# EAGLE design connect4V2 (EAGLE 9.7.0)
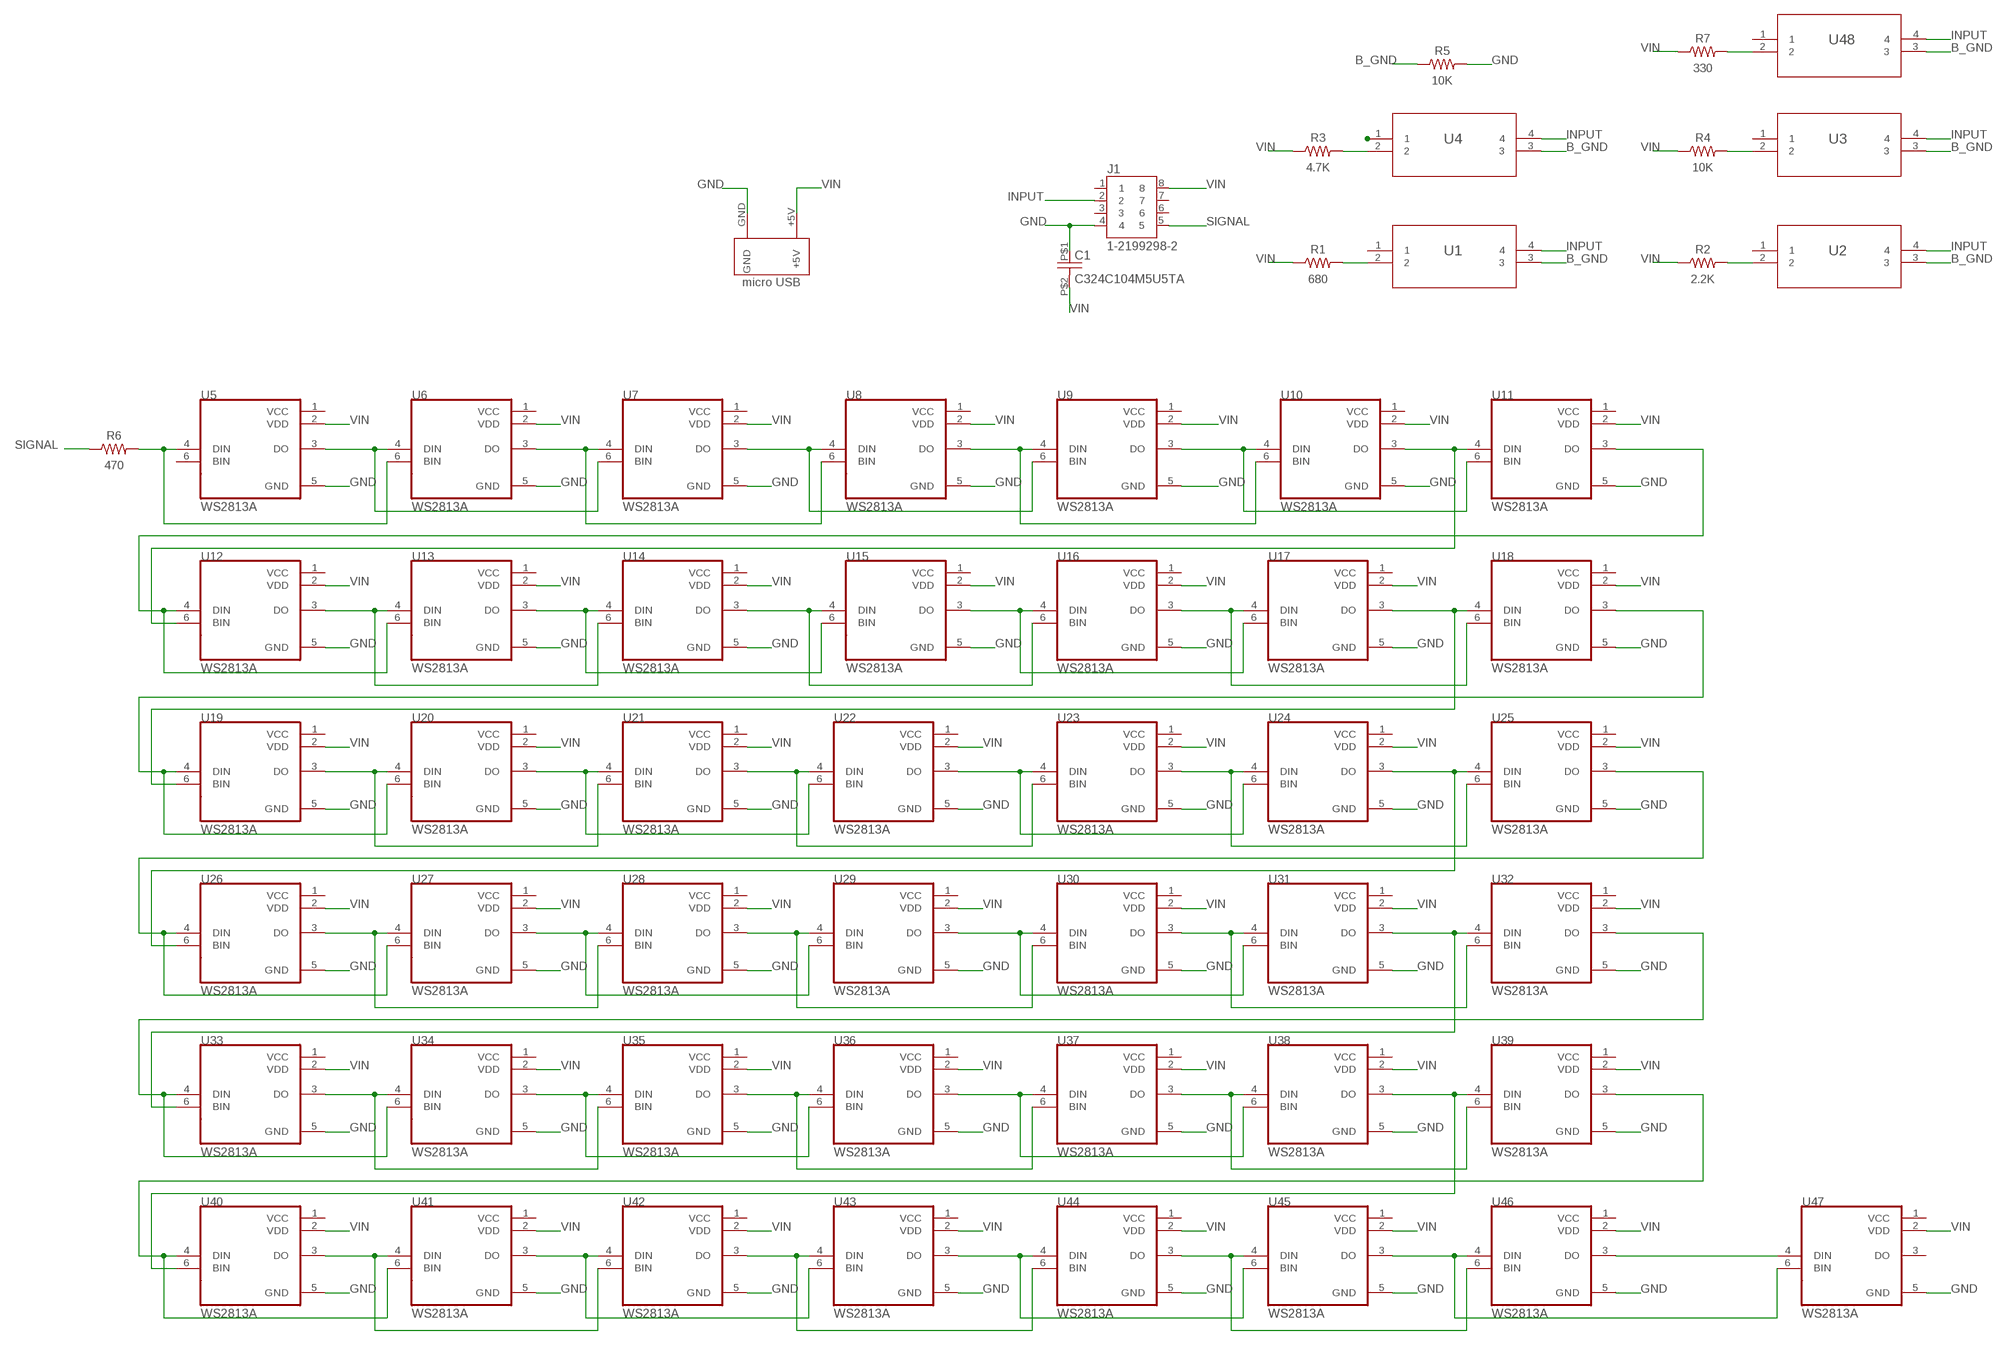
[diagram p0: schematic, sheet 1]

## Parts
C1  C324C104M5U5TA  [CAPRR254W55L508T318H508P]
J1  1-2199298-2  [TE_1-2199298-2]
R1  680  R-US_AXIAL-7.2MM-PITCH  [RESAD724W46L381D178B]
R2  2.2K  R-US_AXIAL-7.2MM-PITCH  [RESAD724W46L381D178B]
R3  4.7K  R-US_AXIAL-7.2MM-PITCH  [RESAD724W46L381D178B]
R4  10K  R-US_AXIAL-7.2MM-PITCH  [RESAD724W46L381D178B]
R5  10K  R-US_AXIAL-7.2MM-PITCH  [RESAD724W46L381D178B]
R6  470  R-US_AXIAL-7.2MM-PITCH  [RESAD724W46L381D178B]
R7  330  R-US_AXIAL-7.2MM-PITCH  [RESAD724W46L381D178B]
U1  PTS526_SK15_SMTR2_LFSSMT_FS-M  [SMT_FS-M]
U2  PTS526_SK15_SMTR2_LFSSMT_FS-M  [SMT_FS-M]
U3  PTS526_SK15_SMTR2_LFSSMT_FS-M  [SMT_FS-M]
U4  PTS526_SK15_SMTR2_LFSSMT_FS-M  [SMT_FS-M]
U5  WS2813A  [LED_WS2813A]
U6  WS2813A  [LED_WS2813A]
U7  WS2813A  [LED_WS2813A]
U8  WS2813A  [LED_WS2813A]
U9  WS2813A  [LED_WS2813A]
U10  WS2813A  [LED_WS2813A]
U11  WS2813A  [LED_WS2813A]
U12  WS2813A  [LED_WS2813A]
U13  WS2813A  [LED_WS2813A]
U14  WS2813A  [LED_WS2813A]
U15  WS2813A  [LED_WS2813A]
U16  WS2813A  [LED_WS2813A]
U17  WS2813A  [LED_WS2813A]
U18  WS2813A  [LED_WS2813A]
U19  WS2813A  [LED_WS2813A]
U20  WS2813A  [LED_WS2813A]
U21  WS2813A  [LED_WS2813A]
U22  WS2813A  [LED_WS2813A]
U23  WS2813A  [LED_WS2813A]
U24  WS2813A  [LED_WS2813A]
U25  WS2813A  [LED_WS2813A]
U26  WS2813A  [LED_WS2813A]
U27  WS2813A  [LED_WS2813A]
U28  WS2813A  [LED_WS2813A]
U29  WS2813A  [LED_WS2813A]
U30  WS2813A  [LED_WS2813A]
U31  WS2813A  [LED_WS2813A]
U32  WS2813A  [LED_WS2813A]
U33  WS2813A  [LED_WS2813A]
U34  WS2813A  [LED_WS2813A]
U35  WS2813A  [LED_WS2813A]
U36  WS2813A  [LED_WS2813A]
U37  WS2813A  [LED_WS2813A]
U38  WS2813A  [LED_WS2813A]
U39  WS2813A  [LED_WS2813A]
U40  WS2813A  [LED_WS2813A]
U41  WS2813A  [LED_WS2813A]
U42  WS2813A  [LED_WS2813A]
U43  WS2813A  [LED_WS2813A]
U44  WS2813A  [LED_WS2813A]
U45  WS2813A  [LED_WS2813A]
U46  WS2813A  [LED_WS2813A]
U47  WS2813A  [LED_WS2813A]
U48  PTS526_SK15_SMTR2_LFSSMT_FS-M  [SMT_FS-M]
U$1  MICROUSB-5P-FEMALE-AB  [MICROUSB-5P-FEMALE-AB]

## Nets
B_GND: R5.1 U1.3 U2.3 U3.3 U4.3 U48.3
GND: C1.P$1 J1.4 R5.2 U5.5(GND) U6.5(GND) U7.5(GND) U8.5(GND) U9.5(GND) U10.5(GND) U11.5(GND) U12.5(GND) U13.5(GND) U14.5(GND) U15.5(GND) U16.5(GND) U17.5(GND) U18.5(GND) U19.5(GND) U20.5(GND) U21.5(GND) U22.5(GND) U23.5(GND) U24.5(GND) U25.5(GND) U26.5(GND) U27.5(GND) U28.5(GND) U29.5(GND) U30.5(GND) U31.5(GND) U32.5(GND) U33.5(GND) U34.5(GND) U35.5(GND) U36.5(GND) U37.5(GND) U38.5(GND) U39.5(GND) U40.5(GND) U41.5(GND) U42.5(GND) U43.5(GND) U44.5(GND) U45.5(GND) U46.5(GND) U47.5(GND) U$1.GND
INPUT: J1.2 U1.4 U2.4 U3.4 U4.4 U48.4
N$1: U6.3(DO) U7.4(DIN) U8.6(BIN)
N$2: U5.3(DO) U6.4(DIN) U7.6(BIN)
N$3: U7.3(DO) U8.4(DIN) U9.6(BIN)
N$4: U8.3(DO) U9.4(DIN) U10.6(BIN)
N$5: U10.3(DO) U11.4(DIN) U12.6(BIN)
N$6: U13.3(DO) U14.4(DIN) U15.6(BIN)
N$7: U30.3(DO) U31.4(DIN) U32.6(BIN)
N$8: U12.3(DO) U13.4(DIN) U14.6(BIN)
N$9: U14.3(DO) U15.4(DIN) U16.6(BIN)
N$10: U15.3(DO) U16.4(DIN) U17.6(BIN)
N$11: U16.3(DO) U17.4(DIN) U18.6(BIN)
N$12: U17.3(DO) U18.4(DIN) U19.6(BIN)
N$13: U19.3(DO) U20.4(DIN) U21.6(BIN)
N$14: U20.3(DO) U21.4(DIN) U22.6(BIN)
N$15: U21.3(DO) U22.4(DIN) U23.6(BIN)
N$16: U22.3(DO) U23.4(DIN) U24.6(BIN)
N$17: U23.3(DO) U24.4(DIN) U25.6(BIN)
N$18: U24.3(DO) U25.4(DIN) U26.6(BIN)
N$19: U18.3(DO) U19.4(DIN) U20.6(BIN)
N$20: U26.3(DO) U27.4(DIN) U28.6(BIN)
N$21: U27.3(DO) U28.4(DIN) U29.6(BIN)
N$22: U28.3(DO) U29.4(DIN) U30.6(BIN)
N$23: U29.3(DO) U30.4(DIN) U31.6(BIN)
N$24: U4.1
N$25: U31.3(DO) U32.4(DIN) U33.6(BIN)
N$26: U25.3(DO) U26.4(DIN) U27.6(BIN)
N$27: U33.3(DO) U34.4(DIN) U35.6(BIN)
N$28: U34.3(DO) U35.4(DIN) U36.6(BIN)
N$29: U35.3(DO) U36.4(DIN) U37.6(BIN)
N$30: U36.3(DO) U37.4(DIN) U38.6(BIN)
N$31: U37.3(DO) U38.4(DIN) U39.6(BIN)
N$32: U38.3(DO) U39.4(DIN) U40.6(BIN)
N$33: U32.3(DO) U33.4(DIN) U34.6(BIN)
N$34: U40.3(DO) U41.4(DIN) U42.6(BIN)
N$35: U41.3(DO) U42.4(DIN) U43.6(BIN)
N$36: U42.3(DO) U43.4(DIN) U44.6(BIN)
N$37: U11.3(DO) U12.4(DIN) U13.6(BIN)
N$38: U43.3(DO) U44.4(DIN) U45.6(BIN)
N$39: U44.3(DO) U45.4(DIN) U46.6(BIN)
N$40: U45.3(DO) U46.4(DIN) U47.6(BIN)
N$41: U39.3(DO) U40.4(DIN) U41.6(BIN)
N$42: U46.3(DO) U47.4(DIN)
N$43: R1.2 U1.2
N$44: R3.2 U4.2
N$45: R2.2 U2.2
N$46: R4.2 U3.2
N$47: U9.3(DO) U10.4(DIN) U11.6(BIN)
N$48: R7.2 U48.2
N$49: R6.2 U5.4(DIN) U6.6(BIN)
SIGNAL: J1.5 R6.1
VIN: C1.P$2 J1.8 R1.1 R2.1 R3.1 R4.1 R7.1 U5.2(VDD) U6.2(VDD) U7.2(VDD) U8.2(VDD) U9.2(VDD) U10.2(VDD) U11.2(VDD) U12.2(VDD) U13.2(VDD) U14.2(VDD) U15.2(VDD) U16.2(VDD) U17.2(VDD) U18.2(VDD) U19.2(VDD) U20.2(VDD) U21.2(VDD) U22.2(VDD) U23.2(VDD) U24.2(VDD) U25.2(VDD) U26.2(VDD) U27.2(VDD) U28.2(VDD) U29.2(VDD) U30.2(VDD) U31.2(VDD) U32.2(VDD) U33.2(VDD) U34.2(VDD) U35.2(VDD) U36.2(VDD) U37.2(VDD) U38.2(VDD) U39.2(VDD) U40.2(VDD) U41.2(VDD) U42.2(VDD) U43.2(VDD) U44.2(VDD) U45.2(VDD) U46.2(VDD) U47.2(VDD) U$1.+5V
Unconnected: J1.1 J1.3 J1.6 J1.7 U1.1 U2.1 U3.1 U5.6(BIN) U47.3(DO) U48.1

## Power pins joined to a net without a drawn wire
VCC: U5.1(VCC) U6.1(VCC) U7.1(VCC) U8.1(VCC) U9.1(VCC) U10.1(VCC) U11.1(VCC) U12.1(VCC) U13.1(VCC) U14.1(VCC) U15.1(VCC) U16.1(VCC) U17.1(VCC) U18.1(VCC) U19.1(VCC) U20.1(VCC) U21.1(VCC) U22.1(VCC) U23.1(VCC) U24.1(VCC) U25.1(VCC) U26.1(VCC) U27.1(VCC) U28.1(VCC) U29.1(VCC) U30.1(VCC) U31.1(VCC) U32.1(VCC) U33.1(VCC) U34.1(VCC) U35.1(VCC) U36.1(VCC) U37.1(VCC) U38.1(VCC) U39.1(VCC) U40.1(VCC) U41.1(VCC) U42.1(VCC) U43.1(VCC) U44.1(VCC) U45.1(VCC) U46.1(VCC) U47.1(VCC)

## Library data of the parts
C1 = ceramicCap:C324C104M5U5TA: Cap Ceramic 0.1uF 50V Z5U 20% Radial 2.54mm 85C Bulk; MANUFACTURER: Kemet
J1 = 8PinDip:1-2199298-2: CONN IC DIP SOCKET 8POS TIN; COMMENT: 1-2199298-2
R1-R7 = Resistor:R-US: Resistor Fixed - ANSI; CATEGORY: Resistor; SUB-CATEGORY: Fixed
U1-U4 U48 = SMD_Button:PTS526_SK15_SMTR2_LFS; BUILT_BY: EMA_Matt; COPYRIGHT: Copyright (C) 2018 Accelerated Designs. All rights reserved; MANUFACTURER_PART_NUMBER: PTS526 SK15 SMTR2 LFS; SOURCELIBRARY: C&K_2019-11-15; VENDOR: C&K
U5-U47 = WS2813A:WS2813A: Intelligent control LED integrated light source; MANUFACTURER: Worldsemi; STANDARD: Manufacturer Recommendations
U$1 = MICROUSB-5P-FEMALE-AB:MICROUSB-5P-FEMALE-AB

## Board
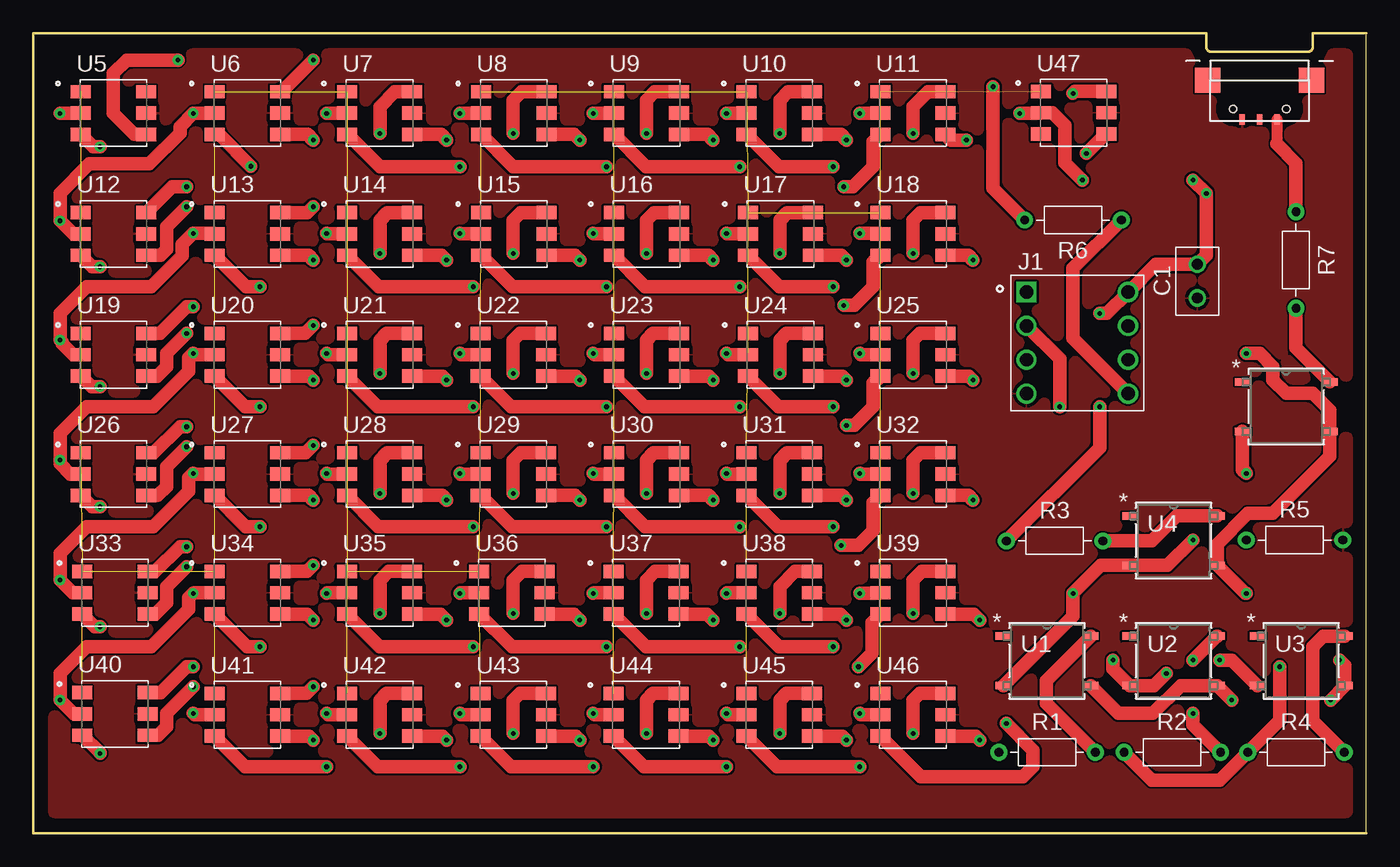
[diagram p1: board, top side]
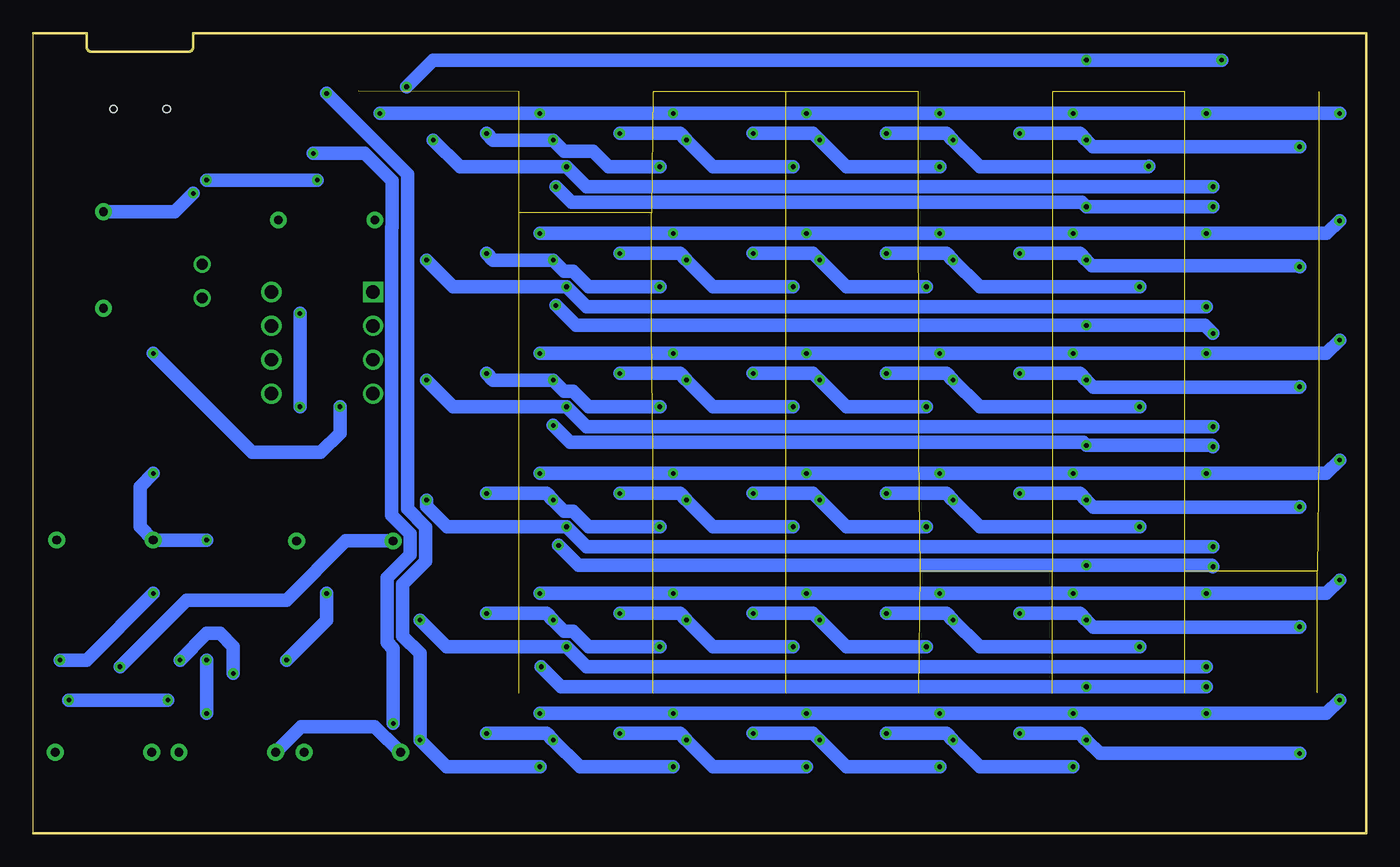
[diagram p2: board, bottom side, seen from below]

Size 100 x 60 mm. Coordinates in mm from the lower left corner, seen from the top.
Outline: 100,0 100,60 96,60 96,59 arc-90 95.6,58.6 88.4,58.6 arc-90 88,59 88,60 0,60 0,0 100,0
Copper layers (1*16): Top 0.035mm / dielectric 1.5mm / Bottom 0.035mm
Design rules "default": minimum track width 6mil, minimum drill 0.35mm, track to track 6mil, track to pad 6mil, pad to pad 6mil, via to via 6mil, smd to smd 6mil, copper to edge 40mil, drill to drill 6mil, minimum pad ring 10mil, minimum via ring 8mil, stop-mask expansion 4mil, vias tented up to drill 0mil, thermal gap 10mil

### Footprints (pad centres in the part's own frame; a part is rotated, then mirrored left to right if it is on the bottom)
CAPRR254W55L508T318H508P = drill 0.8: P$1 -1.27,0; P$2 1.27,0
TE_1-2199298-2 = drill 1 square: 1 -3.81,3.81 | drill 1: 2 -3.81,1.27; 3 -3.81,-1.27; 4 -3.81,-3.81; 5 3.81,-3.81; 6 3.81,-1.27; 7 3.81,1.27; 8 3.81,3.81
RESAD724W46L381D178B = drill 0.66 pad 1.26: 1 -3.62,0; 2 3.62,0
SMT_FS-M = smd 1.156 x 0.559: 1 -3.283,1.854; 2 3.283,1.854; 3 -3.283,-1.854; 4 3.283,-1.854
LED_WS2813A = smd 1.5 x 1: 1 -2.45,1.6; 2 -2.45,0; 3 -2.45,-1.6; 4 2.45,-1.6; 5 2.45,0; 6 2.45,1.6
MICROUSB-5P-FEMALE-AB = smd 0.406 x 0.813: +5V -1.3,0; GND 1.3,0; NC 0,0 | smd 1.9 x 1.9: HOLD1 -3.9,-2.95; HOLD2 3.9,-2.95 | hole 0.55: 2,-0.8; -2,-0.8

### Placement (x,y rotation side)
C1  87.33,41.41 90 top
J1  78.33,36.79 0 top
R1  76.06,6.08 0 top
R2  85.45,6.08 0 top
R3  76.63,21.93 0 top
R4  94.73,6.08 0 top
R5  94.63,22 0 top
R6  78,46 180 top
R7  94.73,43 270 top
U1  76.06,12.93 0 top
U2  85.55,12.93 0 top
U3  95.12,12.93 0 top
U4  85.55,21.95 0 top
U5  6.02,54.02 0 top
U6  16.05,54.02 0 top
U7  25.98,54.02 0 top
U8  36.04,54.02 0 top
U9  46,54.02 0 top
U10  55.96,54.02 0 top
U11  65.99,54.02 0 top
U12  6.02,44.96 0 top
U13  16.05,44.96 0 top
U14  25.98,44.96 0 top
U15  36.04,44.96 0 top
U16  46,44.96 0 top
U17  56.06,44.96 0 top
U18  65.99,44.96 0 top
U19  6.02,35.9 0 top
U20  16.05,35.9 0 top
U21  25.98,35.9 0 top
U22  36.01,35.9 0 top
U23  46,35.9 0 top
U24  56.06,35.9 0 top
U25  65.99,35.9 0 top
U26  6.02,26.94 0 top
U27  16.05,26.94 0 top
U28  25.98,26.94 0 top
U29  36.01,26.94 0 top
U30  46,26.94 0 top
U31  55.96,26.94 0 top
U32  65.99,26.94 0 top
U33  6.12,18.05 0 top
U34  16.05,18.05 0 top
U35  25.98,18.05 0 top
U36  35.91,18.05 0 top
U37  45.97,18.05 0 top
U38  55.96,18.05 0 top
U39  65.99,18.05 0 top
U40  6.12,8.96 0 top
U41  16.05,8.89 0 top
U42  25.98,8.89 0 top
U43  36.01,8.89 0 top
U44  45.97,8.89 0 top
U45  55.96,8.89 0 top
U46  65.99,8.89 0 top
U47  78.06,54.04 0 top
U48  94,32 0 top
U$1  92,53.53 180 top

### Tracks (layer width: path | path; a pad name or v marks a point on that pad's centre or on a via)
B_GND  (via drill 0.35)
  Top 1.016: v91,27 90.72,27.28 U48.3 | v87,22 85.1,20.1 U4.3 80.1,20.1 v78,18 78,16.3 U1.3 | U3.3 89.92,13 v89,13 | v85,12 84.08,11.08 U2.3 81,12.34 v81,13
  Bottom 1.016: v91,27 92,26 92,22.99 R5.1 v87,22 | v89,13 87,15 86,15 85,14 v85,12 | v81,13 78,16 v78,18
GND
  pour Top: -3,65.5 106,65.5 109.5,62 109.5,-8.5 -4,-8.5 -10,-2.5 -10,58 -3,65
INPUT  (via drill 0.35)
  Top 1.016: v97.33,10 U3.4 98.41,12.59 v98,13 | v89.91,10 U2.4 86.08,11.08 84,9 81.42,9 U1.4 | v91,18 90.93,18 U4.4 88.83,21.7 91.14,24 93,24 97.28,28.28 U48.4 97.28,31.72 96,33 94,33 93,34 93,35 92,36 v91,36 | v77,32 77,35.58 J1.2
  Bottom 1.016: v98,13 96,13 v91,18 | v97.33,10 v89.91,10 | v77,32 77,30 78.43,28.57 83.57,28.57 v91,36
N$1  (via drill 0.35)
  Top 1.016: U6.3 13.93,52.42 v16.32,50.03 | U7.4 30.58,52.42 v31,52 | v36,52.5 36,55 36.62,55.62 U8.6
  Bottom 1.016: v16.32,50.03 16.35,50 29,50 v31,52 31.5,52.5 v36,52.5
N$2  (via drill 0.35)
  Top 1.016: U5.3 4.49,51.5 v5,51.5 | U6.4 20.58,52.42 v21,52 | v26,52.5 26,54.5 27.12,55.62 U7.6
  Bottom 1.016: v5,51.5 20.5,51.5 v21,52 21.5,52.5 v26,52.5
N$3  (via drill 0.35)
  Top 1.016: U7.3 23.58,52.42 26,50 v32,50 | U8.4 40.58,52.42 v41,52 | v46,52.5 46,55 46.62,55.62 U9.6
  Bottom 1.016: v32,50 39,50 v41,52 41.5,52.5 v46,52.5
N$4  (via drill 0.35)
  Top 1.016: U8.3 36.01,50 v43,50 | U9.4 50.58,52.42 v51,52 | v56,52.5 56,55 56.62,55.62 U10.6
  Bottom 1.016: v43,50 49,50 v51,52 51.5,52.5 v56,52.5
N$5  (via drill 0.35)
  Top 1.016: U10.3 55.93,50 v60,50 | v70,52 68.86,52 U11.4 | U12.6 10.41,48.5 v11.5,48.5
  Bottom 1.016: v70,52 68,50 v60,50 58.5,48.5 v11.5,48.5
N$6  (via drill 0.35)
  Top 1.016: U13.3 15.96,41 v17,41 | U14.4 30.64,43.36 v31,43 | v36,43.5 36,46 36.56,46.56 U15.6
  Bottom 1.016: v17,41 29,41 v31,43 31.5,43.5 v36,43.5
N$7  (via drill 0.35)
  Top 1.016: U30.3 45.89,23 v53,23 | U31.4 60.66,25.34 v61,25 | v66,25.5 66,28 66.54,28.54 U32.6
  Bottom 1.016: v53,23 58.35,23 59.52,24.17 60.17,24.17 v61,25 61.5,25.5 v66,25.5
N$8  (via drill 0.35)
  Top 1.016: U12.3 4.43,42.5 v5,42.5 | U13.4 20.64,43.36 v21,43 | v26,43.5 26,46 26.56,46.56 U14.6
  Bottom 1.016: v26,43.5 21.5,43.5 v21,43 20.57,42.57 5.07,42.57 v5,42.5
N$9  (via drill 0.35)
  Top 1.016: U14.3 25.89,41 v33,41 | U15.4 40.64,43.36 v41,43 | v46,43.5 46,46 46.56,46.56 U16.6
  Bottom 1.016: v33,41 39,41 v41,43 41.5,43.5 v46,43.5
N$10  (via drill 0.35)
  Top 1.016: U15.3 35.95,41 v43,41 | U16.4 50.64,43.36 v51,43 | v56,43.5 56,46 56.56,46.56 U17.6
  Bottom 1.016: v43,41 49,41 v51,43 51.5,43.5 v56,43.5
N$11  (via drill 0.35)
  Top 1.016: U16.3 45.91,41 v53,41 | U17.4 60.64,43.36 v61,43 | v66,43.5 66,46 66.56,46.56 U18.6
  Bottom 1.016: v53,41 58.35,41 59.52,42.17 60.17,42.17 v61,43 65.5,43 v66,43.5
N$12  (via drill 0.35)
  Top 1.016: U17.3 55.97,41 v60,41 | U18.4 70.14,43.36 v70.5,43 | v12,39.5 11.5,39.5 9.5,37.5 U19.6
  Bottom 1.016: v70.5,43 68.5,41 v60,41 58.5,39.5 v12,39.5
N$13  (via drill 0.35)
  Top 1.016: U19.3 4.37,33.5 v5,33.5 | U20.4 20.7,34.3 v21,34 | v26,34.5 26,37 26.5,37.5 U21.6
  Bottom 1.016: v26,34.5 21.5,34.5 v21,34 20.47,33.47 5.03,33.47 v5,33.5
N$14  (via drill 0.35)
  Top 1.016: U20.3 15.9,32 v17,32 | U21.4 30.7,34.3 v31,34 | v36,34.5 36,37 36.5,37.5 U22.6
  Bottom 1.016: v17,32 29,32 v31,34 31.5,34.5 v36,34.5
N$15  (via drill 0.35)
  Top 1.016: U21.3 25.83,32 v33,32 | U22.4 40.7,34.3 v41,34 | v46,34.5 46,37 46.5,37.5 U23.6
  Bottom 1.016: v33,32 39,32 v41,34 41.5,34.5 v46,34.5
N$16  (via drill 0.35)
  Top 1.016: U22.3 35.86,32 v43,32 | U23.4 50.7,34.3 v51,34 | v56,34.5 56,37 56.5,37.5 U24.6
  Bottom 1.016: v43,32 49,32 v51,34 51.5,34.5 v56,34.5
N$17  (via drill 0.35)
  Top 1.016: U23.3 45.85,32 v53,32 | U24.4 60.7,34.3 v61,34 | v66,34.5 66,37 66.5,37.5 U25.6
  Bottom 1.016: v53,32 58.35,32 59.52,33.17 60.17,33.17 v61,34 65.5,34 v66,34.5
N$18  (via drill 0.35)
  Top 1.016: U24.3 55.91,32 v60,32 | U25.4 70.2,34.3 v70.5,34 | U26.6 9.04,28.54 11,30.5 v11.5,30.5
  Bottom 1.016: v70.5,34 68.5,32 v60,32 58.5,30.5 v11.5,30.5
N$19  (via drill 0.35)
  Top 1.016: U18.3 63,42.82 63,41 61.6,39.6 v60.8,39.6 | v11.5,37.5 10,36 10,35 9.3,34.3 U19.4 | v21,38.1 20.4,37.5 U20.6
  Bottom 1.016: v60.8,39.6 59.3,38.1 v21,38.1 12.1,38.1 v11.5,37.5
N$20  (via drill 0.35)
  Top 1.016: U26.3 4.41,24.5 v5,24.5 | U27.4 20.66,25.34 v21,25 | v26,25.5 26,28 26.54,28.54 U28.6
  Bottom 1.016: v26,25.5 21.5,25.5 v21,25 20.47,24.47 5.03,24.47 v5,24.5
N$21  (via drill 0.35)
  Top 1.016: U27.3 15.94,23 v17,23 | U28.4 30.66,25.34 v31,25 | v36,25.5 36,28 36.54,28.54 U29.6
  Bottom 1.016: v17,23 29,23 v31,25 31.5,25.5 v36,25.5
N$22  (via drill 0.35)
  Top 1.016: U28.3 25.87,23 v33,23 | U29.4 40.66,25.34 v41,25 | v46,25.5 46,28 46.54,28.54 U30.6
  Bottom 1.016: v33,23 39,23 v41,25 41.5,25.5 v46,25.5
N$23  (via drill 0.35)
  Top 1.016: U29.3 35.9,23 v43,23 | U30.4 50.66,25.34 v51,25 | v56,25.5 56,28 56.54,28.54 U31.6
  Bottom 1.016: v43,23 49,23 v51,25 51.5,25.5 v56,25.5
N$25  (via drill 0.35)
  Top 1.016: U31.3 55.85,23 v60,23 | U32.4 70.16,25.34 v70.5,25 | U33.6 9.15,19.65 11,21.5 v11.5,21.5
  Bottom 1.016: v11.5,21.5 58.5,21.5 v60,23 68.95,23 70.5,24.55 v70.5,25
N$26  (via drill 0.35)
  Top 1.016: U25.3 63,33.76 63,32 61.6,30.6 v61,30.6 | v11.5,29 10,27.5 10,26 9.34,25.34 U26.4 | v21,29.1 20.44,28.54 U27.6
  Bottom 1.016: v11.5,29 11.6,29.1 v21,29.1 21.23,29.33 59.73,29.33 v61,30.6
N$27  (via drill 0.35)
  Top 1.016: U33.3 4.62,15.5 v5,15.5 | U34.4 20.55,16.45 v21,16 | v26,16.5 26,19 26.65,19.65 U35.6
  Bottom 1.016: v26,16.5 21.5,16.5 v21,16 20.47,15.47 5.03,15.47 v5,15.5
N$28  (via drill 0.35)
  Top 1.016: U34.3 16.05,14 v17,14 | U35.4 30.55,16.45 v31,16 | v36,16.5 36,19 36.65,19.65 U36.6
  Bottom 1.016: v17,14 29,14 v31,16 31.5,16.5 v36,16.5
N$29  (via drill 0.35)
  Top 1.016: U35.3 25.98,14 v33,14 | U36.4 40.55,16.45 v41,16 | v46,16.5 46,19 46.65,19.65 U37.6
  Bottom 1.016: v33,14 39,14 v41,16 41.5,16.5 v46,16.5
N$30  (via drill 0.35)
  Top 1.016: U36.3 35.91,14 v43,14 | U37.4 50.55,16.45 v51,16 | v56,16.5 56,18.5 57.15,19.65 U38.6
  Bottom 1.016: v43,14 49,14 v51,16 51.5,16.5 v56,16.5
N$31  (via drill 0.35)
  Top 1.016: U37.3 45.97,14 v53,14 | U38.4 60.55,16.45 v61,16 | v66,16.5 66,19 66.65,19.65 U39.6
  Bottom 1.016: v53,14 58.35,14 59.52,15.17 60.17,15.17 v61,16 61.5,16.5 v66,16.5
N$32  (via drill 0.35)
  Top 1.016: U38.3 55.96,14 v60,14 | U39.4 70.55,16.45 v71,16 | U40.6 9.56,10.56 11.5,12.5 v12,12.5
  Bottom 1.016: v71,16 69,14 v60,14 58.5,12.5 v12,12.5
N$33  (via drill 0.35)
  Top 1.016: U32.3 63,24.8 63,22.7 61.9,21.6 v60.6,21.6 | v11.5,20 10,18.5 10,17.3 9.15,16.45 U33.4 | v21,20.1 20.55,19.65 U34.6
  Bottom 1.016: v60.6,21.6 59.1,20.1 v21,20.1 11.6,20.1 v11.5,20
N$34  (via drill 0.35)
  Top 1.016: U40.3 5,6.03 v5,6 | U41.4 20.71,7.29 v21,7 | v26,7.5 26,10 26.5,10.5 U42.6
  Bottom 1.016: v5,6 20,6 v21,7 21.5,7.5 v26,7.5
N$35  (via drill 0.35)
  Top 1.016: U41.3 15.89,5 v22,5 | U42.4 30.71,7.29 v31,7 | v36,7.5 36,10 36.5,10.5 U43.6
  Bottom 1.016: v22,5 29,5 v31,7 31.5,7.5 v36,7.5
N$36  (via drill 0.35)
  Top 1.016: U42.3 25.82,5 v32,5 | U43.4 40.71,7.29 v41,7 | v46,7.5 46,10 46.5,10.5 U44.6
  Bottom 1.016: v32,5 39,5 v41,7 41.5,7.5 v46,7.5
N$37  (via drill 0.35)
  Top 1.016: U11.3 63,51.88 63,50 61.5,48.5 v60.8,48.5 | v11.5,47 10,45.5 10,43.81 9.55,43.36 U12.4 | v21,47 20.56,46.56 U13.6
  Bottom 1.016: v11.5,47 v21,47 21.33,47.33 59.63,47.33 v60.8,48.5
N$38  (via drill 0.35)
  Top 1.016: U43.3 35.85,5 v42,5 | U44.4 50.71,7.29 v51,7 | v56,7.5 56,10 56.5,10.5 U45.6
  Bottom 1.016: v42,5 49,5 v51,7 51.5,7.5 v56,7.5
N$39  (via drill 0.35)
  Top 1.016: U44.3 45.81,5 v52,5 | U45.4 60.71,7.29 v61,7 | v66,7.5 66,10 66.5,10.5 U46.6
  Bottom 1.016: v52,5 59,5 v61,7 61.5,7.5 v66,7.5
N$40  (via drill 0.35)
  Top 1.016: U45.3 55.8,5 v62,5 | U46.4 70.71,7.29 v71,7 | v78,55.5 78.14,55.64 U47.6
  Bottom 1.016: v62,5 69,5 v71,7 71,13.5 72.3,14.8 72.3,18.67 70.56,20.41 70.56,22.95 71.94,24.33 71.94,44.97 71.92,44.98 71.92,49.42 v78,55.5
N$41  (via drill 0.35)
  Top 1.016: v61.9,12.5 62.9,13.5 62.9,15.81 U39.3 | v12,11 10,9 10,8 9.36,7.36 U40.4 | v21,11 20.49,10.49 U41.6
  Bottom 1.016: v61.9,12.5 60.4,11 v21,11 v12,11
N$42  (via drill 0.35)
  Top 1.016: U46.3 66.58,4.25 74.25,4.25 75,5 75,6.25 v73,8.25 | v79,51 80.44,52.44 U47.4
  Bottom 1.016: v73,8.25 73,13.85 73.47,14.32 73.47,19.15 71.72,20.89 71.72,22.46 73.11,23.85 73.11,45.45 73.09,45.47 73.09,48.94 75.15,51 v79,51
N$43
  Top 1.016: U1.2 76,11.44 76,9.76 R1.2
N$44
  Top 1.016: U4.2 85.8,23.8 83.93,21.93 R3.2
N$45  (via drill 0.35)
  Top 1.016: R2.2 87,8.15 v87,9 | v87,13 88.78,14.78 U2.2
  Bottom 1.016: v87,9 v87,13
N$46
  Top 1.016: R4.2 96,8.43 96,14 96.78,14.78 U3.2
N$47  (via drill 0.35)
  Top 1.016: U9.3 45.97,50 v53,50 | U10.4 60.58,52.42 v61,52 | v66,52.5 66,54.5 67.12,55.62 U11.6
  Bottom 1.016: v53,50 56.85,50 58.02,51.17 60.17,51.17 v61,52 65.5,52 v66,52.5
N$48
  Top 1.016: R7.2 94.73,36.4 U48.2
N$49  (via drill 0.35)
  Top 1.016: R6.2 72,48.38 v72,56 | v10.85,58 7,58 6,57 6,54 7.58,52.42 U5.4 | v21,58 18.62,55.62 U6.6
  Bottom 1.016: v72,56 70,58 v21,58 v10.85,58
SIGNAL
  Top 1.016: J1.5 78,37.12 78,42.38 R6.1
VCC  (42 unrouted)
VIN  (via drill 0.35)
  Top 0.813: U$1.+5V 93.3,51.7
  Top 1.016: R2.1 83.91,4 89.03,4 R4.1 93.5,8.47 v93.5,12.5 | U5.2 2.02,54.02 v2,54 | U6.2 12.02,54.02 v12,54 11,53 11,52.5 8.7,50.2 4.2,50.2 2,48 v2,45.95 2.99,44.96 U12.2 | v22,54 23.51,54 U7.2 | v32,54 33.57,54 U8.2 | v42,54 43.53,54 U9.2 | v52,54 53.49,54 U10.2 | v62,54 63.52,54 U11.2 | v74,54 75.57,54 U47.2 76.46,54.04 77.4,53.1 77.4,50.3 v78.7,49 | v80,39 80.54,39 J1.8 84.22,42.68 C1.P$2 88,43.35 v88,48 v87,49 | v80,32 80,28.92 R3.1 | v62,45 63.5,45 U18.2 | U13.2 13.56,45 v12,45 11.17,44.17 11.17,43.32 8.85,41 4,41 2,39 v2,37 2.16,36.84 2.16,36.73 2.99,35.9 U19.2 | U25.2 62.1,35.9 v62,36 | U21.2 22.1,35.9 v22,36 | U22.2 32.1,35.9 v32,36 | U23.2 42.1,35.9 v42,36 | U24.2 52.1,35.9 v52,36 | U15.2 32.04,44.96 v32,45 | v42,45 42.04,44.96 U16.2 | v22,45 22.04,44.96 U14.2 | U17.2 52.04,44.96 v52,45 | U20.2 12.1,35.9 v12,36 11.67,35.67 11.67,34.67 9,32 4,32 2,30 v2,28 2,27.73 2.79,26.94 U26.2 | U32.2 62.06,26.94 v62,27 | U31.2 52.06,26.94 v52,27 | U30.2 42.06,26.94 v42,27 | U29.2 32.06,26.94 v32,27 | U28.2 22.06,26.94 v22,27 | U27.2 12.06,26.94 v12,27 11.67,26.67 11.67,25.67 9,23 4,23 2,21 v2,19 2.95,18.05 U33.2 | v62,18 63.49,18 U39.2 | U34.2 12.05,18.05 v12,18 11.67,17.67 11.67,16.81 8.86,14 4,14 2,12 v2,10 3.04,8.96 U40.2 | U35.2 22.05,18.05 v22,18 | U36.2 32.05,18.05 v32,18 | U37.2 42.05,18.05 v42,18 | U38.2 52.05,18.05 v52,18 | U46.2 62.11,8.89 v62,9 | U45.2 52.11,8.89 v52,9 | U44.2 42.11,8.89 v42,9 | U43.2 32.11,8.89 v32,9 | U42.2 22.11,8.89 v22,9 | U41.2 12.11,8.89 v12,9 | 93.3,51.7 94.73,50.27 R7.1
  Bottom 1.016: R7.1 89.38,46.62 v88,48 | R2.1 79.91,8 74.4,8 73.48,7.08 73.44,7.08 R1.1 | v2,54 v12,54 v22,54 v32,54 v42,54 v52,54 v62,54 v74,54 | v80,39 v80,32 | v2,45.95 2.95,45 v12,45 v22,45 v32,45 v42,45 v52,45 v62,45 | v62,36 v52,36 v42,36 v32,36 v22,36 v12,36 3,36 v2,37 | v2,28 3,27 v12,27 v22,27 v32,27 v42,27 v52,27 v62,27 | v2,19 3,18 v12,18 v22,18 v32,18 v42,18 v52,18 v62,18 | v2,10 3,9 v12,9 v22,9 v32,9 v42,9 v52,9 v62,9 | v87,49 v78.7,49 | v93.5,12.5 88.5,17.5 81,17.5 76.57,21.93 R3.1